# EAGLE design Pi_OS_v1 (EAGLE 7.6.0)
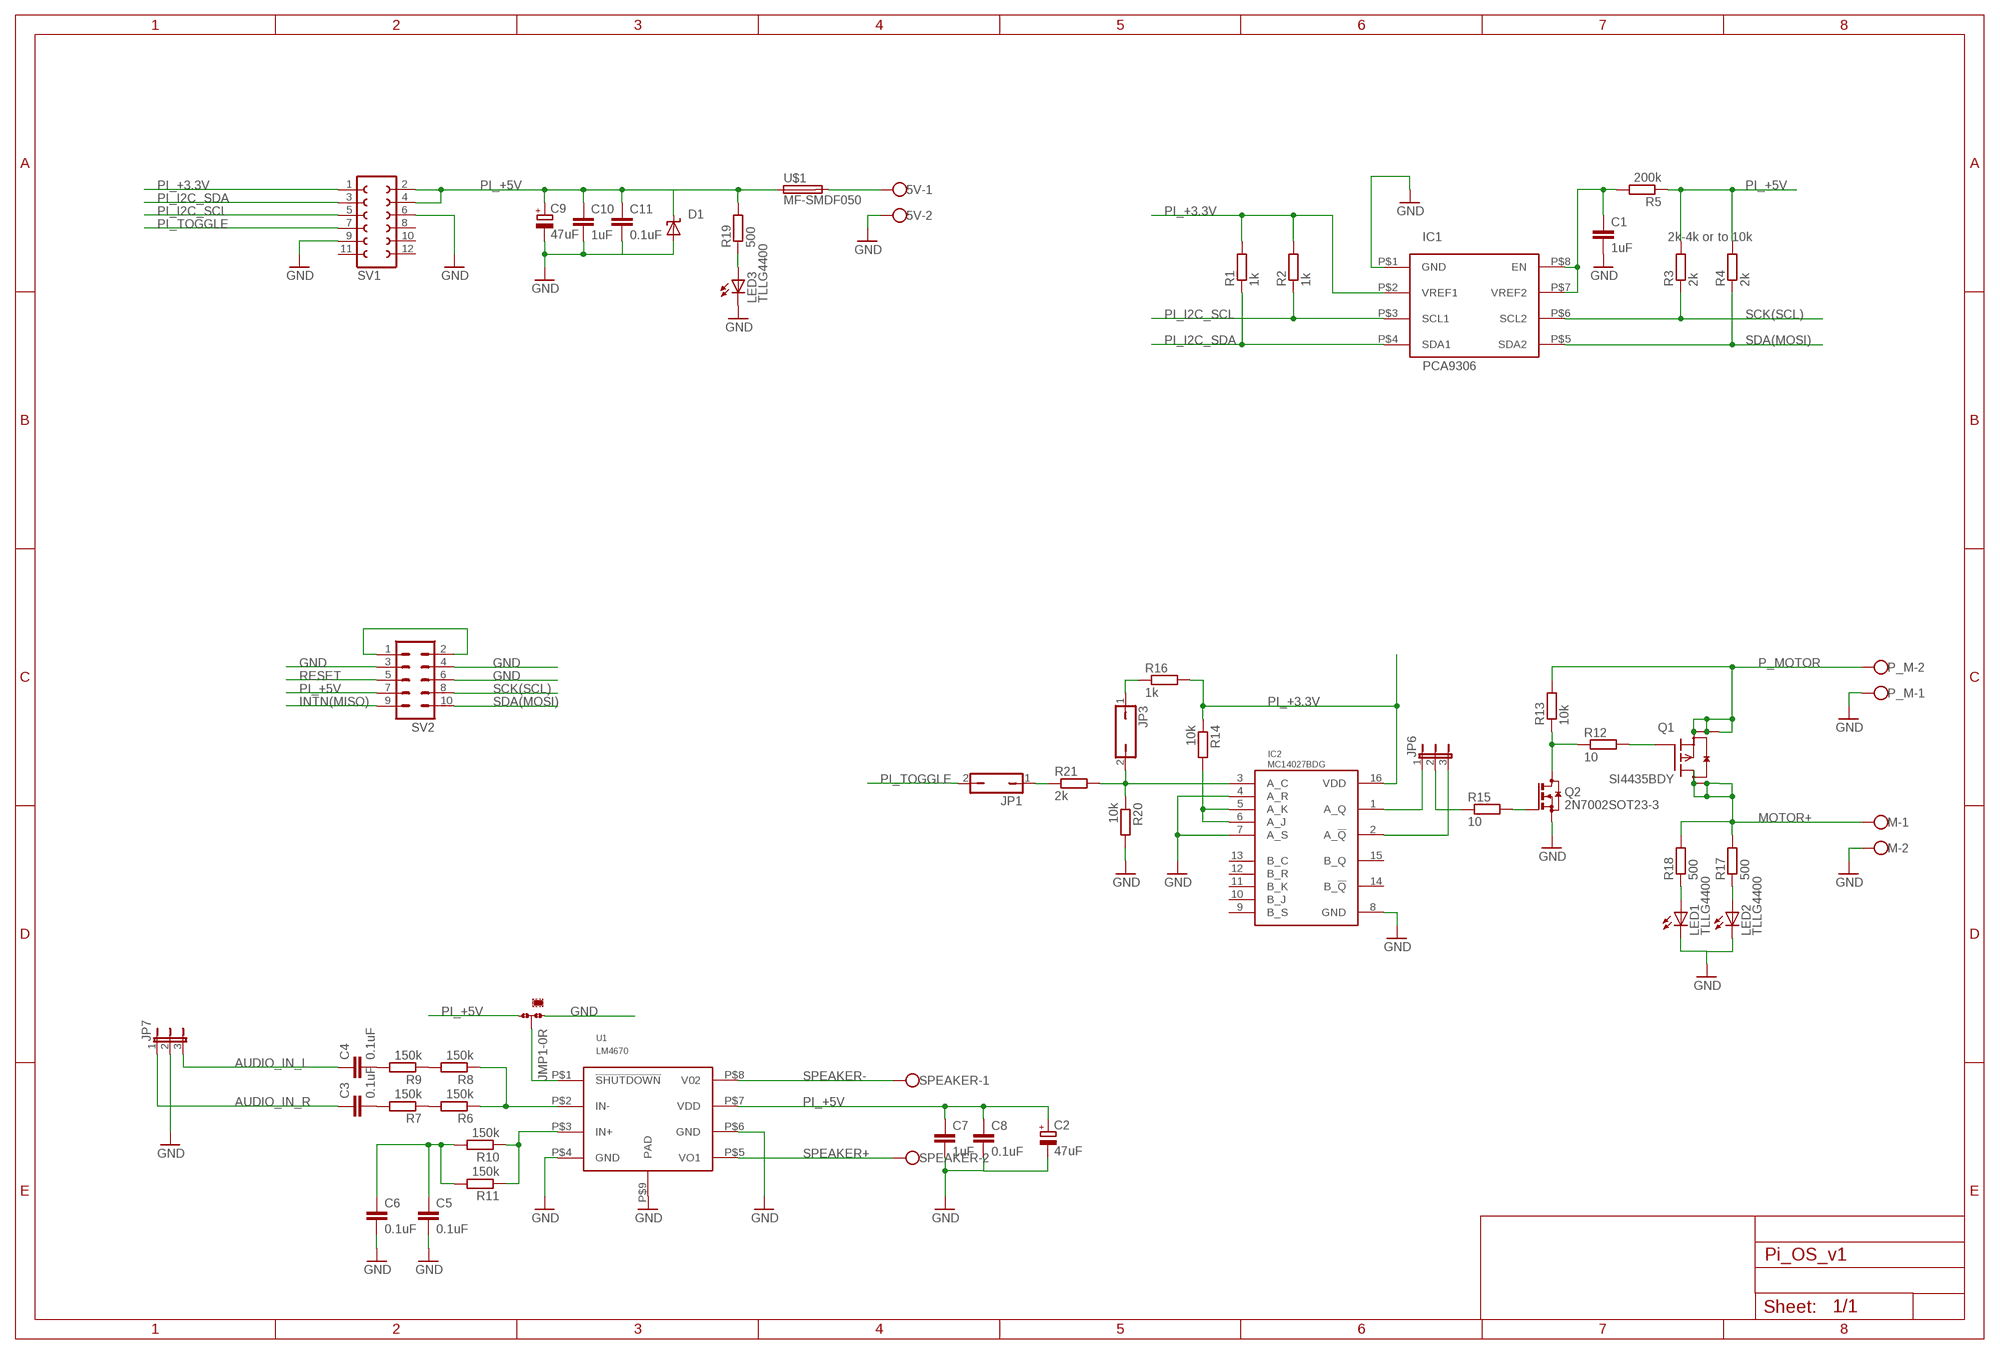
[diagram p0: schematic, sheet 1]

## Parts
5V  W237-102  [W237-102]
C1  1uF  C-EUC1206  [C1206]
C2  47uF  CPOL-EU153CLV-0505  [153CLV-0505]
C3  0.1uF  C-EUC1206  [C1206]
C4  0.1uF  C-EUC1206  [C1206]
C5  0.1uF  C-EUC1206  [C1206]
C6  0.1uF  C-EUC1206  [C1206]
C7  1uF  C-EUC1206  [C1206]
C8  0.1uF  C-EUC1206  [C1206]
C9  47uF  CPOL-EU153CLV-0505  [153CLV-0505]
C10  1uF  C-EUC1206  [C1206]
C11  0.1uF  C-EUC1206  [C1206]
D1  SUPPRESSOR-SMBJ  [SMBJ]
IC1  PCA9306  [TSSOP8]
IC2  MC14027BDG  [SOIC16]
JMP1  0R-JUMPB  [B0R-JMP]
JP1  JP1Q  [JP1]
JP3  JP1Q  [JP1]
JP6  JP2E  [JP2]
JP7  JP2E  [JP2]
LED1  TLLG4400  [LED3MM]
LED2  TLLG4400  [LED3MM]
LED3  TLLG4400  [LED3MM]
M  W237-102  [W237-102]
P_M  W237-102  [W237-102]
Q1  SI4435BDY  [SOIC8]
Q2  2N7002SOT23-3  [SOT23]
R1  1k  R-EU_R0603  [R0603]
R2  1k  R-EU_R0603  [R0603]
R3  2k  R-EU_R0603  [R0603]
R4  2k  R-EU_R0603  [R0603]
R5  200k  R-EU_R0603  [R0603]
R6  150k  R-EU_R0603  [R0603]
R7  150k  R-EU_R0603  [R0603]
R8  150k  R-EU_R0603  [R0603]
R9  150k  R-EU_R0603  [R0603]
R10  150k  R-EU_R0603  [R0603]
R11  150k  R-EU_R0603  [R0603]
R12  10  R-EU_R0603  [R0603]
R13  10k  R-EU_R0603  [R0603]
R14  10k  R-EU_R0603  [R0603]
R15  10  R-EU_R0603  [R0603]
R16  1k  R-EU_R0603  [R0603]
R17  500  R-EU_R0603  [R0603]
R18  500  R-EU_R0603  [R0603]
R19  500  R-EU_R0603  [R0603]
R20  10k  R-EU_R0603  [R0603]
R21  2k  R-EU_R0603  [R0603]
SPEAKER  W237-102  [W237-102]
SV1  FE06-2  [FE06-2]
SV2  MA05-2  [MA05-2]
U1  LM4670  [MSOP-08P]
U$1  MF-SMDF050  [MF-SMDF050]

## Nets
AUDIO_IN_L: C4.1 JP7.3
AUDIO_IN_R: C3.1 JP7.1
GND: 5V.2 C1.2 C2.- C5.2 C6.2 C7.2 C8.2 C9.- C10.2 C11.2 D1.A IC1.P$1(GND) IC2.4(A_R) IC2.7(A_S) IC2.8(GND) JMP1.1 JP7.2 LED1.K(C) LED2.K(C) LED3.K(C) M.2 P_M.1 Q2.2(S) R20.2 SV1.6 SV1.9 SV2.3 SV2.4 SV2.6 U1.P$4(GND) U1.P$6(GND) U1.P$9(PAD)
INTN(MISO): SV2.9
MOTOR+ [sup_M]: M.1 Q1.5(D) Q1.6(D) Q1.7(D) Q1.8(D) R17.2 R18.2
N$1: JP6.2 R15.1
N$2: IC2.1(A_Q) JP6.1
N$3: IC2.2(A_!Q) JP6.3
N$4: 5V.1 U$1.2
N$5: C1.1 IC1.P$7(VREF2) IC1.P$8(EN) R5.2
N$6: IC2.5(A_K) IC2.6(A_J) R14.2
N$7: IC2.3(A_C) JP3.2 R20.1 R21.2
N$8: SV2.1 SV2.2
N$9: R6.1 R8.1 U1.P$2(IN-)
N$10: R10.1 R11.1 U1.P$3(IN+)
N$11: R6.2 R7.1
N$12: R8.2 R9.1
N$13: C3.2 R7.2
N$14: C4.2 R9.2
N$15: C5.1 C6.1 R10.2 R11.2
N$16: Q2.3(D) R12.1 R13.1
N$17: Q1.4(G) R12.2
N$18: Q2.1(G) R15.2
N$19: JP3.1 R16.1
N$20: JP1.1 R21.1
N$21: JMP1.2 U1.P$1(!SHUTDOWN)
N$27: LED2.A R17.1
N$28: LED1.A R18.1
N$29: LED3.A R19.1
P_MOTOR [sup_M]: P_M.2 Q1.1(S) Q1.2(S) Q1.3(S) R13.2
PI_+3.3V: IC1.P$2(VREF1) IC2.16(VDD) R1.2 R2.2 R14.1 R16.2 SV1.1
PI_+5V [sup5v]: C2.+ C7.1 C8.1 C9.+ C10.1 C11.1 D1.C JMP1.3 R3.2 R4.2 R5.1 R19.2 SV1.2 SV1.4 SV2.7 U1.P$7(VDD) U$1.1
PI_I2C_SCL: IC1.P$3(SCL1) R2.1 SV1.5
PI_I2C_SDA: IC1.P$4(SDA1) R1.1 SV1.3
PI_TOGGLE: JP1.2 SV1.7
RESET: SV2.5
SCK(SCL): IC1.P$6(SCL2) R3.1 SV2.8
SDA(MOSI): IC1.P$5(SDA2) R4.1 SV2.10
SPEAKER+: SPEAKER.2 U1.P$5(VO1)
SPEAKER-: SPEAKER.1 U1.P$8(V02)
Unconnected: IC2.9(B_S) IC2.10(B_J) IC2.11(B_K) IC2.12(B_R) IC2.13(B_C) IC2.14(B_!Q) IC2.15(B_Q) SV1.8 SV1.10 SV1.11 SV1.12

## Notes on the sheet
- 2k-4k or to 10k

## Library data of the parts
5V M P_M SPEAKER = con-wago-500:W237-102: WAGO SCREW CLAMP; MPN: 237-102; OC_FARNELL: unknown; OC_NEWARK: 70K9898
C1 C3-C8 C10 C11 = rcl:C-EU: CAPACITOR, European symbol
C2 C9 = rcl:CPOL-EU: POLARIZED CAPACITOR, European symbol
D1 = diode:SUPPRESSOR-: Suppressor diode
IC1 = on-semiconductor:PCA9306: ON SEMICONDUCTOR PCA9306DTR2G Voltage Level Translator, Bidirectional, 2 Input, 64 mA, 1.5 ns, 0 V to 5.5 V, TSSOP-8, http://si.farnell.com/on-semiconductor/pca9306dtr2g/level-translator-2i-p-tssop-8/dp/2464616
IC2 = on-semiconductor:MC14027BDG: ON SEMICONDUCTOR MC14027BDG Flip-Flop, Master/Slave,Complementary Output, Positive Edge, MC14027, JK, 150 ns, 13 MHz, 8.8 mA; http://si.farnell.com/on-semiconductor/mc14027bdg/4000-cmos-smd-4027-soic16-15v/dp/9666354
JMP1 = jump-0r-smd:0R-JUMP: SMD 0R 0805 Jumper
JP1 JP3 = jumper:JP1Q: JUMPER
JP6 JP7 = jumper:JP2E: JUMPER
LED1-LED3 = led:TLLG4400: Low Current (2mA) LED 3 mm Tinted Diffused Package color GREEN Source: Data sheet <http://www.farnell.com/datasheets/391098.pdf>; MF: VISHAY SEMICONDUCTOR; OC_FARNELL: 1612435
Q1 = m-pad-2.1:SI4435BDY: Vishay Siliconix P-Channel 30-V (D-S) MOSFET FEATURES: TrenchFET Power MOSFET Advanced High Cell Density Process Lead Free APPLICATIONS: Load Switches Battery Switches Please send any comments to: messi@users.sourceforge.net
Q2 = transistor-small-signal:2N7002: N-channel enhancement mode Field-Effect Transistor (FET) in a plastic package using TrenchMOS technology. SOT23
R1-R21 = rcl:R-EU_: RESISTOR, European symbol
SV1 = con-lsta:FE06-2: FEMALE HEADER; OC_FARNELL: unknown; OC_NEWARK: unknown
SV2 = con-lstb:MA05-2: PIN HEADER; OC_FARNELL: unknown; OC_NEWARK: unknown
U1 = texas:LM4670: TEXAS INSTRUMENTS LM4670SD Audio Power Amplifier, D, 1 Channel, 3 W, 2.4V to 5.5V, LLP, 8 Pins
U$1 = fuse:MF-SMDF: MF-SMDF Series - PRC Resettable Fuses Source: http://www.farnell.com/datasheets/716597.pdf

## Net classes
0 default: clearance 0.254 mm
1 sup5v: width 0.762 mm, clearance 0.254 mm
2 sup3v: width 0.254 mm, clearance 0.381 mm
3 sup_M: width 6.35 mm, clearance 0.508 mm

## Board
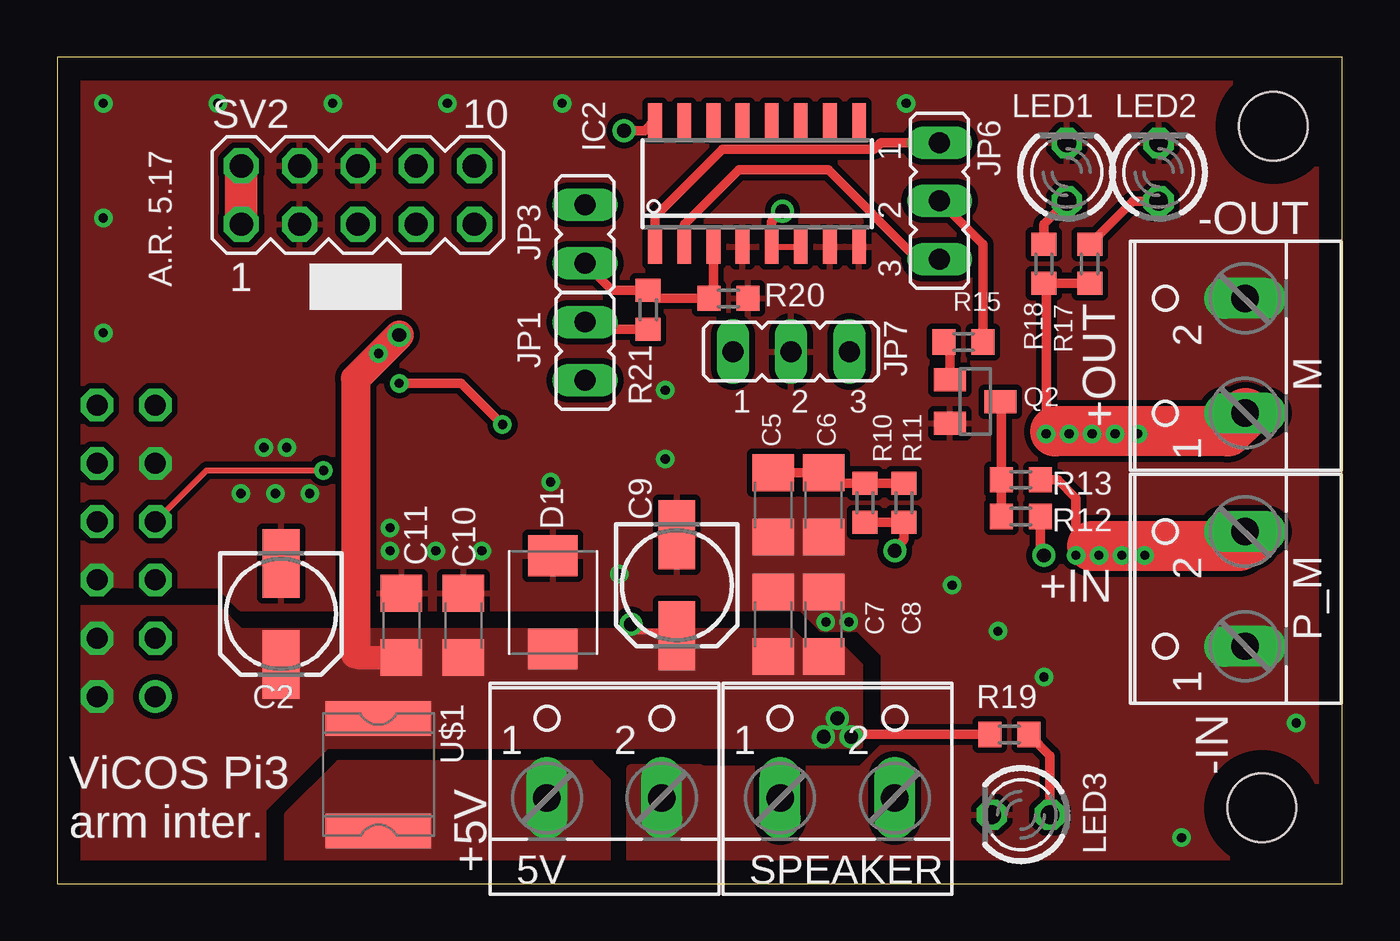
[diagram p1: board, top side]
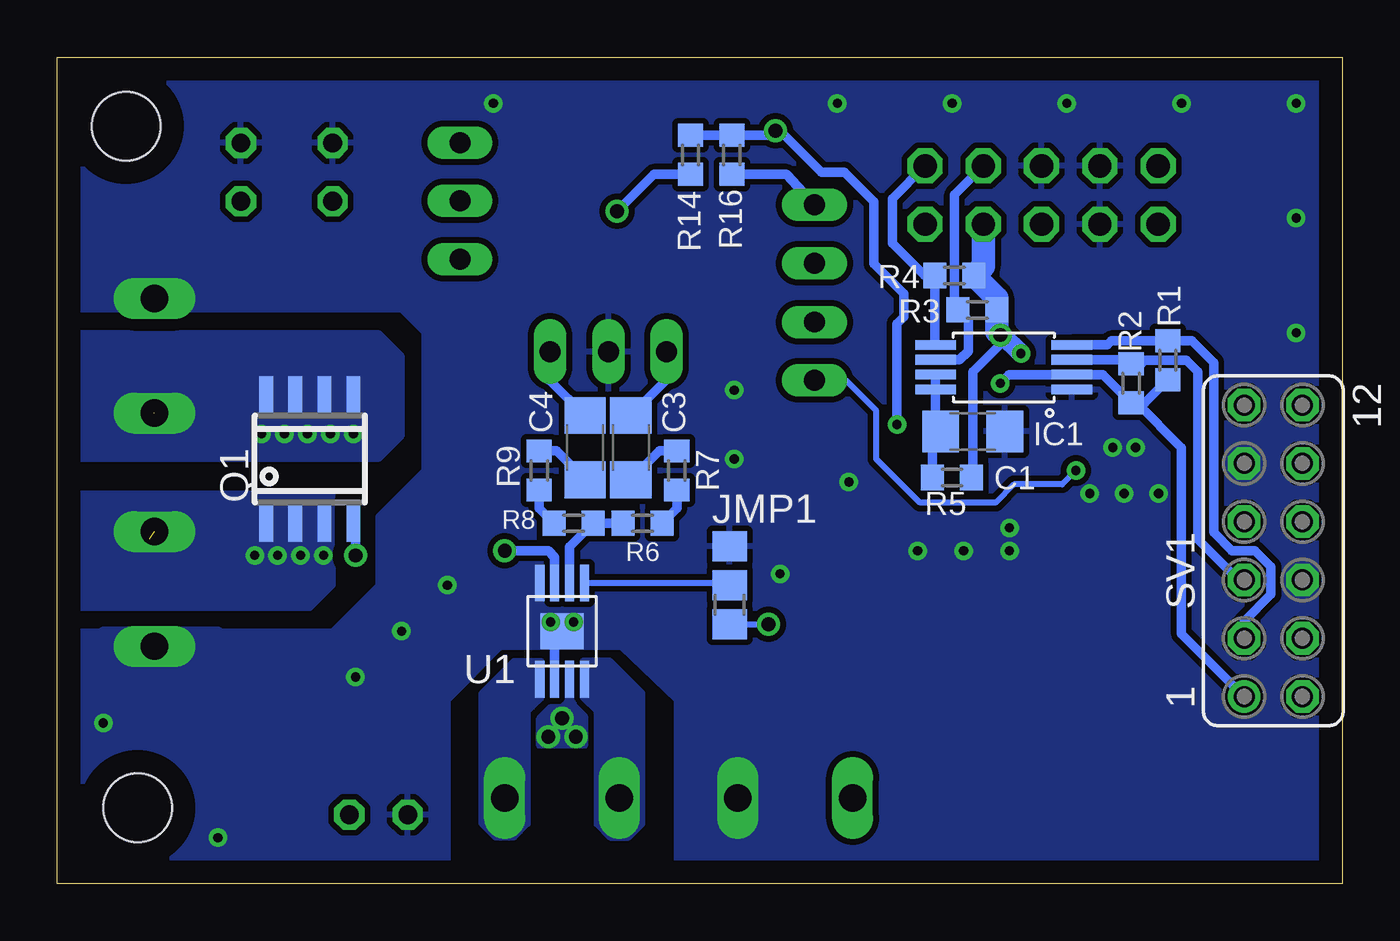
[diagram p2: board, bottom side, seen from below]

Size 56 x 36 mm. Coordinates in mm from the lower left corner, seen from the top.
Outline: 0,36 0,0 56,0 56,36 0,36
Copper layers (1*16): Top 0.035mm / dielectric 1.5mm / Bottom 0.035mm
Design rules "default": minimum track width 10mil, minimum drill 24mil, track to track 8mil, track to pad 8mil, pad to pad 8mil, via to via 8mil, smd to smd 8mil, copper to edge 40mil, drill to drill 8mil, minimum pad ring 10mil, minimum via ring 8mil, stop-mask expansion 4mil, vias tented up to drill 0mil, thermal gap 10mil
Holes 3 mm at 52.5,3.3 53,33

### Footprints (pad centres in the part's own frame; a part is rotated, then mirrored left to right if it is on the bottom)
W237-102 = drill 1.194 long: 1 -2.5,-1.27; 2 2.5,-1.27
C1206 = smd 1.6 x 1.8: 1 -1.4,0; 2 1.4,0
153CLV-0505 = smd 3 x 1.6: + 2.2,0; - -2.2,0
SMBJ = smd 1.78 x 2.16: A 2.04,0; C -2.03,0
TSSOP8 = smd 0.42 x 1.78: P$1 -0.975,-2.97; P$2 -0.325,-2.97; P$3 0.325,-2.97; P$4 0.975,-2.97; P$5 0.975,2.97; P$6 0.325,2.97; P$7 -0.325,2.97; P$8 -0.975,2.97
SOIC16 = smd 0.6 x 1.5: 1 -4.445,-2.75; 2 -3.175,-2.75; 3 -1.905,-2.75; 4 -0.635,-2.75; 5 0.635,-2.75; 6 1.905,-2.75; 7 3.175,-2.75; 8 4.445,-2.75; 9 4.445,2.75; 10 3.175,2.75; 11 1.905,2.75; 12 0.635,2.75; 13 -0.635,2.75; 14 -1.905,2.75; 15 -3.175,2.75; 16 -4.445,2.75
B0R-JMP = smd 1.5 x 1.3: 1 0,1.7; 2 0,0; 3 0,-1.7
JP1 = drill 0.914 long: 1 0,-1.27; 2 0,1.27
JP2 = drill 0.914 long: 1 -2.54,0; 2 0,0; 3 2.54,0
LED3MM = drill 0.813 octagon: A -1.27,0; K 1.27,0
SOIC8 = smd 0.6 x 1.8: 1 -1.905,-2.7; 2 -0.635,-2.7; 3 0.635,-2.7; 4 1.905,-2.7; 5 1.905,2.7; 6 0.635,2.7; 7 -0.635,2.7; 8 -1.905,2.7
SOT23 = smd 1 x 1.4: 1 -0.95,-1.1; 2 0.95,-1.1; 3 0,1.1
R0603 = smd 1 x 1.1: 1 -0.85,0; 2 0.85,0
FE06-2 = drill 0.914: 1 -6.35,1.27 | drill 0.914 octagon: 2 -6.35,-1.27; 3 -3.81,1.27; 4 -3.81,-1.27; 5 -1.27,1.27; 6 -1.27,-1.27; 7 1.27,1.27; 8 1.27,-1.27; 9 3.81,1.27; 10 3.81,-1.27; 11 6.35,1.27; 12 6.35,-1.27
MA05-2 = drill 1.016 octagon: 1 -5.08,-1.27; 2 -5.08,1.27; 3 -2.54,-1.27; 4 -2.54,1.27; 5 0,-1.27; 6 0,1.27; 7 2.54,-1.27; 8 2.54,1.27; 9 5.08,-1.27; 10 5.08,1.27
MSOP-08P = smd 0.4 x 1.6: P$1 -0.975,-2.1; P$2 -0.325,-2.1; P$3 0.325,-2.1; P$4 0.975,-2.1; P$5 0.975,2.1; P$6 0.325,2.1; P$7 -0.325,2.1; P$8 -0.975,2.1 | smd 1.89 x 1.57: P$9 0,0
MF-SMDF050 = smd 1.5 x 4.6: 1 -2.45,0; 2 2.45,0

### Placement (x,y rotation side)
5V  23.84,5 0 top
C1  16.1,19.7 0 bottom
C2  9.75,11.75 270 top
C3  31,19 270 bottom
C4  33,19 270 bottom
C5  31.2,16.5 270 top
C6  33.4,16.5 270 top
C7  31.2,11.3 90 top
C8  33.4,11.3 90 top
C9  27,13 270 top
C10  17.7,11.25 90 top
C11  15,11.25 90 top
D1  21.6,12.25 90 top
IC1  14.75,22.5 90 bottom
IC2  30.5,30.5 0 top
JMP1  26.7,13 0 bottom
JP1  23,23.2 180 top
JP3  23,28.3 180 top
JP6  38.45,29.75 270 top
JP7  31.98,23.18 0 top
LED1  44,31 90 top
LED2  48,31 90 top
LED3  42,3 180 top
M  50.5,23 90 top
P_M  50.5,12.84 90 top
Q1  45,18.5 0 bottom
Q2  40,21 270 top
R1  7.6,22.8 270 bottom
R2  9.2,21.8 270 bottom
R3  15.9,25 0 bottom
R4  16.9,26.5 0 bottom
R5  17,17.7 180 bottom
R6  30.5,15.7 0 bottom
R7  29,18 90 bottom
R8  33.5,15.7 180 bottom
R9  35,18 90 bottom
R10  35.2,16.6 90 top
R11  36.9,16.6 90 top
R12  42,16 0 top
R13  42,17.6 0 top
R14  28.4,31.75 270 bottom
R15  39.5,23.6 180 top
R16  26.6,31.75 90 bottom
R17  45,27 270 top
R18  43,27 270 top
R19  41.5,6.5 180 top
R20  29.25,25.5 0 top
R21  25.75,25 90 top
SPEAKER  34,5 0 top
SV1  3,14.5 90 bottom
SV2  13.1,30 0 top
U1  34,11 180 bottom
U$1  14,4.75 270 top

### Tracks (layer width: path | path; a pad name or v marks a point on that pad's centre or on a via)
AUDIO_IN_L
  Bottom 0.406: C4.1 34.52,21.92 JP7.3
AUDIO_IN_R
  Bottom 0.406: C3.1 29.44,21.96 JP7.1
GND  (via drill 0.4)
  Bottom 0.406: U1.P$9 34.33,11 U1.P$6
  other vias: 9,19 8,17 11,17 10,19 14.5,14.5 14.5,15.5 24.5,13.5 21.5,17.5 26.5,21.5 16.5,14.5 18.5,14.5 2,24 2,34 2,29 7,34 12,34 17,34 22,34 9.5,17 37,34 49,2 54,7 39,13 41,11 43,9 26.5,18.5 34.5,11.4 33.5,11.4
  pour Bottom: -1,37 -1,-1 29,-1 29,8 31.4,10.3 36.7,10.3 39,8 39,-1 57,-1 57,11 44,11 42,13 42,16 40,18 40,24 41,25 57,25 57,37
  pour Top: -2,38 -2,13 7,13 8,12 34,12 36,10 36,6 35,5 26,5 25,4 25,-2 58,-2 58,38
  pour Bottom (no thermals): 32,14 32,10.3 36,10.3 36,14
  pour Top (no thermals): 0,20 6,20 6,13 0,13
  pour Top (no thermals): 25,5 25,1 28,1 28,5
  pour Bottom (no thermals): 25,6 25,1 28,1 28,6
  pour Bottom (no thermals): 1,22 1,11 6,11 6,22
  pour Bottom (no thermals): 49,11 54,11 54,9 49,9
  pour Top (no thermals): 49,12 49,9 54,9 54,12
  pour Bottom (no thermals): 49,27 49,25.1 54,25.1 54,27
  pour Top (no thermals): 49,27 49,24 54,24 54,27
  pour Top (no thermals): 30,16.4 30,12 34.6,12 34.6,16.4
  pour Top (no thermals): 32.5,12 32.5,11.9 33.3,11.1 35,11.1 35,12
MOTOR+  (via drill 0.4)  (1 unrouted)
  Top 0.406: R17.2 R18.2 43.1,26.05 v43.1,19.6
  Top 2.184: 51.8,20.5 51,19.7 43.5,19.7
  other vias: 44.1,19.6 45.1,19.6 46.1,19.6 47.1,19.6
  pour Bottom (no thermals): 57,24 42,24 41,23 41,19.5 42,18.5 57,18.5
N$1
  Top 0.406: JP6.2 40.35,27.85 R15.1
N$2
  Top 0.406: IC2.1 26.05,29.05 29,32 35.6,32 35.89,32.29 JP6.1
N$3
  Top 0.406: IC2.2 27.32,28.73 29.7,31.1 33.6,31.1 37.49,27.21 JP6.3
N$4
  pour Top (no thermals): 10,-1 24,-1 24,4.5 23.25,5.25 12.25,5.25 10,3
N$5
  Bottom 0.406: IC1.P$7 IC1.P$8 17.72,20.02 C1.1 17.85,19.45 R5.2
N$6  (via drill 0.6)
  Top 0.254: IC2.5 IC2.6
  Top 0.406: v31.6,29.3 31.14,28.84 IC2.5
  Bottom 0.406: R14.2 30,30.9 v31.6,29.3
N$7
  Top 0.406: JP3.2 24.18,25.85 R21.2 26.1,25.5 R20.1 28.59,25.7 IC2.3
N$8
  Top 1.422: SV2.1 SV2.2
N$9
  Bottom 0.406: R6.1 R8.1 33.67,14.68 U1.P$2
N$10  (via drill 0.6)
  Top 0.406: R10.1 R11.1 36.9,15 v36.5,14.5
  Bottom 0.406: U1.P$3 34.33,14.22 34.6,14.5 v36.5,14.5
N$11
  Bottom 0.406: R6.2 29,16.35 R7.1
N$12
  Bottom 0.406: R8.2 35,16.35 R9.1
N$13
  Bottom 0.406: C3.2 29.75,18.85 R7.2
N$14
  Bottom 0.406: C4.2 34.25,18.85 R9.2
N$15
  Top 0.406: C5.1 C6.1 33.65,17.45 R10.2 R11.2
N$16
  Top 0.406: Q2.3 41.15,20.95 R13.1 R12.1
N$17  (via drill 0.6)
  Top 0.406: v43,14.3 42.85,14.45 R12.2
  Bottom 0.406: Q1.4 43,15.71 v43,14.3
N$18
  Top 0.406: R15.2 38.9,23.05 Q2.1
N$19
  Bottom 0.406: JP3.1 24.23,30.9 R16.1
N$20
  Top 0.406: JP1.1 23.32,24.15 R21.1
N$21
  Bottom 0.254: U1.P$1 26.8,13.1 JMP1.2
N$27
  Top 0.406: R17.1 46.88,29.73 LED2.A
N$28
  Top 0.406: R18.1 43,28.73 LED1.A
N$29
  Top 0.406: R19.1 43.27,5.58 LED3.A
P_MOTOR  (via drill 0.4)  (1 unrouted)
  Top 0.406: v44.4,14.3 44.4,16.8 43.6,17.6 R13.2
  Top 2.184: 52,15 51.5,14.7 45.1,14.7
  other vias: 45.4,14.3 46.4,14.3 47.4,14.3
  pour Bottom (no thermals): 57,17 44,17 44,13 45,12 57,12
PI_+3.3V  (via drill 0.4, 0.6)
  Top 0.406: v19.4,20 17.6,21.8 v14.9,21.8 | IC2.16 25.61,32.8 v24.7,32.8
  Bottom 0.406: R2.2 10.43,22.18 IC1.P$2 14.53,22.18 v14.9,21.8 | R1.2 8.6,20.95 R2.2 | SV1.1 7,10.88 7,19 8.95,20.95 R2.2 | R14.1 R16.2 24.9,32.6 v24.7,32.8 24.5,32.8 22.7,31 21.7,31 20.4,29.7 20.4,27 19.1,25.7 19.1,24.7 19.4,24.4 v19.4,20
PI_+5V  (via drill 0.4, 0.6)
  Top 0.254: v25,11.3 25,11 26.7,11 C9.+
  Top 0.406: v34.6,6.4 34.7,6.5 R19.2
  Top 1.016: 13,10 13.15,9.85 C11.1
  Top 1.27: v14.9,23.9 13,22 13,10
  Bottom 0.254: JMP1.3 v25,11.3
  Bottom 0.406: R5.1 16.1,17.75 16.1,22.3 14.9,23.5 v14.9,23.9
  Bottom 0.813: v14,23.1 14.8,23.9 v14.9,23.9
  Bottom 1.016: SV2.7 15.64,26.91 R4.2 15.05,25.5 R3.2 15.05,24.05 v14.9,23.9
  other vias: 33.4,6.4 34,7.2
  pour Top (no thermals): -1,12 -1,-1 9,-1 9,3.25 11.75,6 35,6 35,9.5 34,10.5 32.5,10.5 32,11 8,11 7,12
  pour Bottom (no thermals): 33,6 35,6 35,7.2 34.5,7.7 34,7.7 33.8,7.9 33.8,9.6 33.5,9.6 33.5,7.8 33,7.3
PI_I2C_SCL
  Bottom 0.406: IC1.P$3 9.38,22.82 R2.1 8.75,22.65 8.6,22.8 6.8,22.8 6.3,22.3 6.3,15 4.53,13.23 SV1.5
PI_I2C_SDA
  Bottom 0.406: IC1.P$4 10.22,23.48 10.05,23.65 R1.1 6.55,23.65 5.6,22.7 5.6,15.3 4.8,14.5 3.8,14.5 3.1,13.8 3.1,12.6 4.27,11.43 SV1.3
PI_TOGGLE  (via drill 0.4)
  Top 0.254: SV1.7 6.5,18 v11.6,18
  Bottom 0.254: v11.6,18 12.2,17.4 14.3,17.4 15.1,16.6 18.4,16.6 20.3,18.5 20.3,20.6 21.63,21.93 JP1.2
SCK(SCL)
  Bottom 0.406: IC1.P$6 16.68,22.82 16.3,23.2 16.3,24.55 R3.1 16.9,25.15 16.9,30.01 SV2.8
SDA(MOSI)
  Bottom 0.406: IC1.P$5 17.75,23.5 R4.1 18.2,26.5 19.6,27.9 19.6,29.85 SV2.10
SPEAKER+
  pour Bottom (no thermals): 34.9,9.7 34.9,8.1 35.3,7.7 35.5,7.5 35.5,2.7 35.5,2.6 36.1,2 36.9,2 37.4,2.5 37.5,2.6 37.5,7.9 37.5,8.3 36.1,9.7
SPEAKER-
  pour Bottom (no thermals): 33.1,9.7 33.1,8.1 32.5,7.5 32.5,2.6 31.9,2 31.1,2 30.6,2.5 30.5,2.6 30.5,8.3 31.9,9.7

### Text on the board
tNames: -OUT | A.R. 5.17 | +OUT | +IN | -IN | ViCOS Pi3 / arm inter. | +5V